# EAGLE schematic PCB_tx_snr (EAGLE 9.6.2)
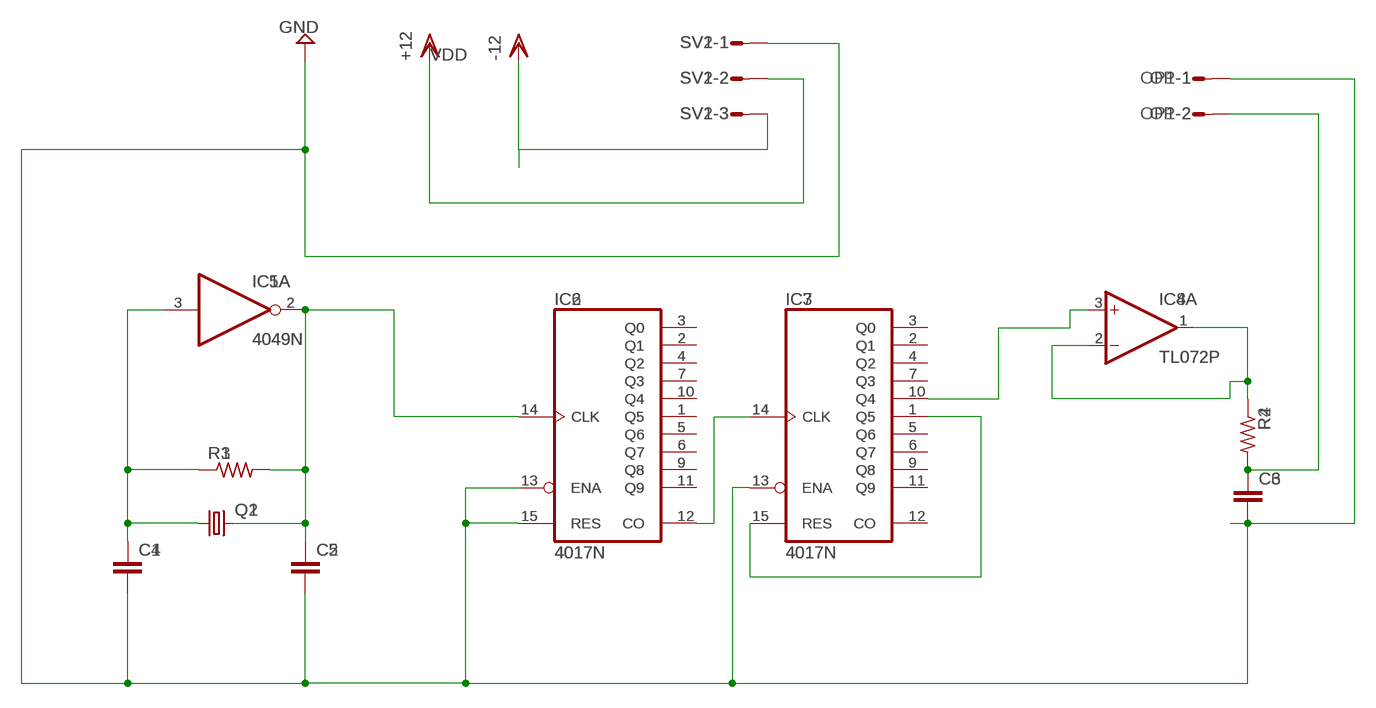
[diagram p0: schematic, sheet 1]

## Parts
C1  C5/3.5  [C5B3.5]
C2  C5/3.5  [C5B3.5]
C3  C5/3.5  [C5B3.5]
C4  C5/3.5  [C5B3.5]
C5  C5/3.5  [C5B3.5]
C6  C5/3.5  [C5B3.5]
IC1  4049N  [DIL16]
IC2  4017N  [DIL16]
IC3  4017N  [DIL16]
IC4  TL072P  [DIL08]
IC5  4049N  [DIL16]
IC6  4017N  [DIL16]
IC7  4017N  [DIL16]
IC8  TL072P  [DIL08]
OP  L02P  [L02P]
OP1  L02P  [L02P]
Q1  CRYSTALHC33U-V  [HC33U-V]
Q2  CRYSTALHC33U-V  [HC33U-V]
R1  R-US_0207/12  [0207/12]
R2  R-US_0207/12  [0207/12]
R3  R-US_0207/12  [0207/12]
R4  R-US_0207/12  [0207/12]
SV1  L03P  [L03P]
SV2  L03P  [L03P]

## Nets
GND: C1.2 C2.2 C3.2 C4.2 C5.2 C6.2 IC2.13(ENA) IC2.15(RES) IC3.13(ENA) IC6.13(ENA) IC6.15(RES) IC7.13(ENA) OP1.1 OP.1 SV1.1 SV2.1
N$1: C1.1 IC1.3(A:I) Q1.1 R1.1
N$2: C2.1 IC1.2(A:O) IC2.14(CLK) Q1.2 R1.2
N$3: C3.1 OP.2 R2.2
N$4: IC3.1(Q5) IC3.15(RES)
N$5: IC3.10(Q4) IC4.3(A:+IN)
N$6: IC4.1(A:OUT) IC4.2(A:-IN) R2.1
N$7: C4.1 IC5.3(A:I) Q2.1 R3.1
N$8: IC2.12(CO) IC3.14(CLK)
N$9: C5.1 IC5.2(A:O) IC6.14(CLK) Q2.2 R3.2
N$10: IC7.1(Q5) IC7.15(RES)
N$11: IC6.12(CO) IC7.14(CLK)
N$12: C6.1 OP1.2 R4.2
N$13: IC8.1(A:OUT) IC8.2(A:-IN) R4.1
N$14: IC7.10(Q4) IC8.3(A:+IN)
N$15: IC2.1(Q5) IC6.1(Q5)
N$16: IC2.2(Q1) IC6.2(Q1)
N$17: IC2.3(Q0) IC6.3(Q0)
N$18: IC2.4(Q2) IC6.4(Q2)
N$19: IC2.5(Q6) IC6.5(Q6)
N$20: IC2.6(Q7) IC6.6(Q7)
N$21: IC2.7(Q3) IC6.7(Q3)
N$22: IC2.9(Q8) IC6.9(Q8)
N$23: IC2.10(Q4) IC6.10(Q4)
N$24: IC2.11(Q9) IC6.11(Q9)
N$25: IC3.2(Q1) IC7.2(Q1)
N$26: IC3.3(Q0) IC7.3(Q0)
N$27: IC3.4(Q2) IC7.4(Q2)
N$28: IC3.5(Q6) IC7.5(Q6)
N$29: IC3.6(Q7) IC7.6(Q7)
N$30: IC3.7(Q3) IC7.7(Q3)
N$31: IC3.9(Q8) IC7.9(Q8)
N$32: IC3.11(Q9) IC7.11(Q9)
N$33: IC3.12(CO) IC7.12(CO)
VDD: SV1.2 SV1.3 SV2.2 SV2.3 ; supply symbol labelled -12, +12
Unconnected: IC1.4(B:O) IC1.5(B:I) IC1.6(C:O) IC1.7(C:I) IC1.9(D:I) IC1.10(D:O) IC1.11(E:I) IC1.12(E:O) IC1.14(F:I) IC1.15(F:O) IC4.5(B:+IN) IC4.6(B:-IN) IC4.7(B:OUT) IC5.4(B:O) IC5.5(B:I) IC5.6(C:O) IC5.7(C:I) IC5.9(D:I) IC5.10(D:O) IC5.11(E:I) IC5.12(E:O) IC5.14(F:I) IC5.15(F:O) IC8.5(B:+IN) IC8.6(B:-IN) IC8.7(B:OUT)

## Power pins joined to a net without a drawn wire
V+: IC4.8(P:V+) IC8.8(P:V+)
V-: IC4.4(P:V-) IC8.4(P:V-)
VDD: IC1.1(P:VDD) IC2.16(VDD) IC3.16(VDD) IC5.1(P:VDD) IC6.16(VDD) IC7.16(VDD)
VSS: IC1.8(P:VSS) IC2.8(VSS) IC3.8(VSS) IC5.8(P:VSS) IC6.8(VSS) IC7.8(VSS)

## Library data of the parts
C1-C6 = capacitor-wima:C: CAPACITOR naming: grid - package width
IC1 IC5 = 40xx:4049: Hex inverting BUFFER
IC2 IC3 IC6 IC7 = 40xx:4017: COUNTER/DIVIDER
IC4 IC8 = linear:TL072: OP AMP
OP OP1 = con-amp-mt:L02P: AMP MT CONNECTOR; OC_FARNELL: unknown; OC_NEWARK: unknown
Q1 Q2 = crystal:CRYSTAL: CRYSTAL; OC_FARNELL: unknown; OC_NEWARK: unknown
R1-R4 = rcl:R-US_: RESISTOR, American symbol; SPICEPREFIX: R
SV1 SV2 = con-amp-mt:L03P: AMP MT CONNECTOR; OC_FARNELL: unknown; OC_NEWARK: unknown